# EAGLE schematic Orion Ground Base (EAGLE 9.2.2)
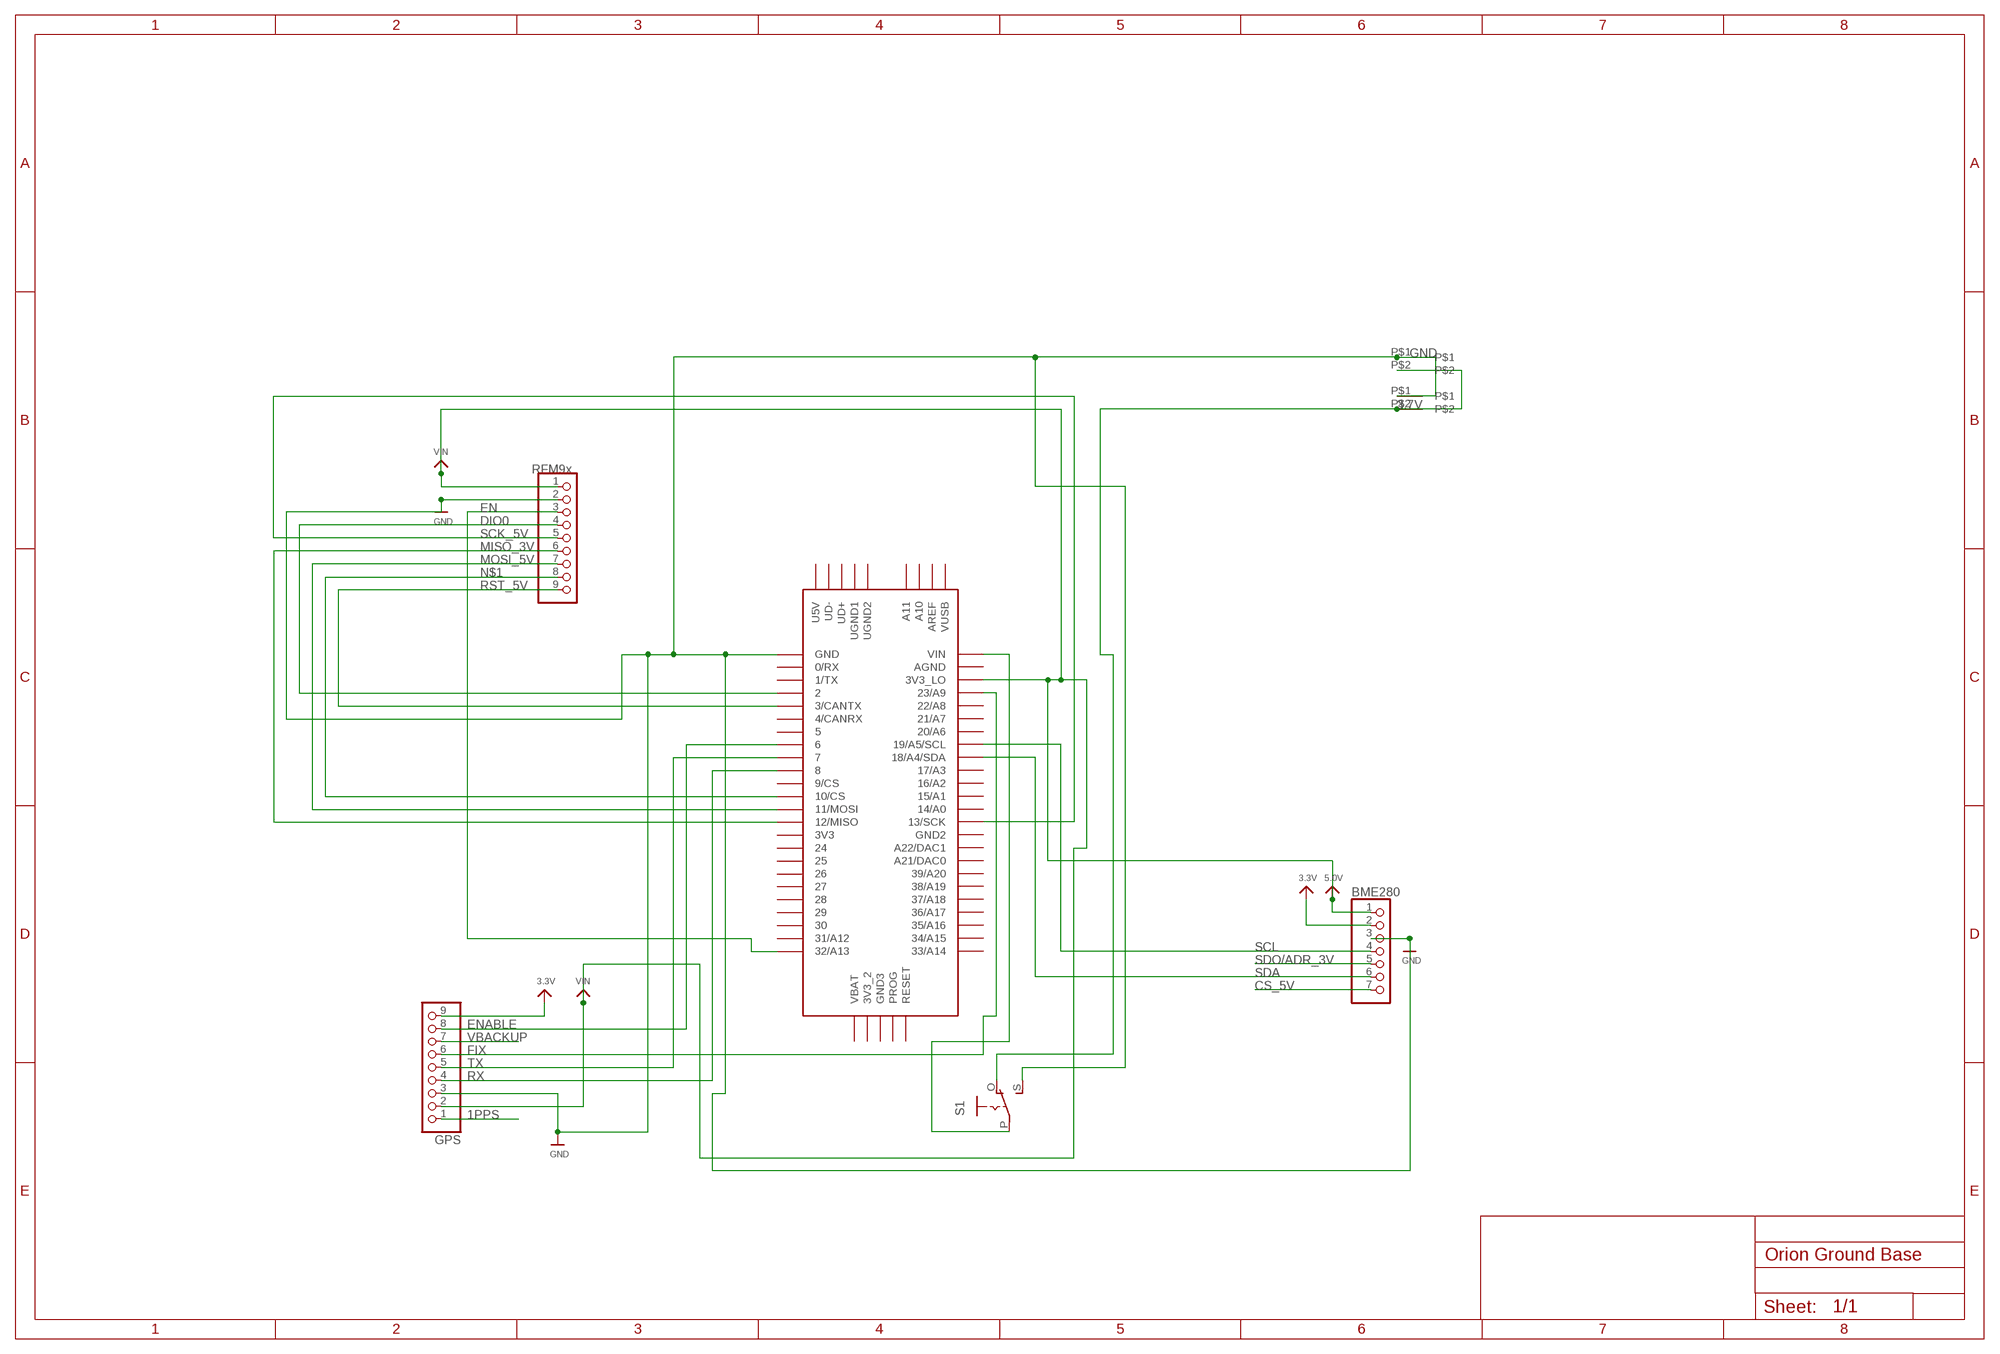
[diagram p0: schematic, sheet 1]

## Parts
BME280  HEADER-1X770MIL  [1X07_ROUND_70]
GPS  HEADER-1X970MIL  [1X09_ROUND_70]
JP3  HEADER-1X970MIL  [1X09_ROUND_70]
S1  EG1218S  [EG1218]
U$1  TEENSY_3.5/3.6  [TEENSY_3.5/3.6]
U$7  2PINS  [2PINS]
U$8  2PINS  [2PINS]

## Nets
1PPS: GPS.1
3.3V: BME280.2 GPS.9
CS_5V: BME280.7
DIO0: JP3.4 U$1.2
EN: JP3.3 U$1.32/A13
ENABLE: GPS.8 U$1.6
FIX: GPS.6 U$1.23/A9
GND: BME280.3 GPS.3 JP3.2 S1.S U$1.GND U$7.P$1 U$8.P$1
MISO_3V: JP3.6 U$1.12/MISO
MOSI_5V: JP3.7 U$1.11/MOSI
N$1: JP3.8 U$1.10/CS
N$3: S1.P U$1.VIN
N$16: S1.O U$7.P$2 U$8.P$2
RST_5V: JP3.9 U$1.3/CANTX
RX: GPS.4 U$1.8
SCK_5V: JP3.5 U$1.13/SCK
SCL: BME280.4 U$1.19/A5/SCL
SDA: BME280.6 U$1.18/A4/SDA
SDO/ADR_3V: BME280.5
TX: GPS.5 U$1.7
VBACKUP: GPS.7
VIN: BME280.1 GPS.2 JP3.1 U$1.3V3_LO ; supply symbol labelled 5.0V
Unconnected: U$1.0/RX U$1.1/TX U$1.3V3 U$1.3V3_2 U$1.4/CANRX U$1.5 U$1.9/CS U$1.14/A0 U$1.15/A1 U$1.16/A2 U$1.17/A3 U$1.20/A6 U$1.21/A7 U$1.21/DAC0(A21/DAC0) U$1.22/A8 U$1.24 U$1.25 U$1.26 U$1.27 U$1.28 U$1.29 U$1.30 U$1.31/A12 U$1.33/A14 U$1.34/A15 U$1.35/A16 U$1.36/A17 U$1.37/A18 U$1.38/A19 U$1.39/A20 U$1.A10 U$1.A11 U$1.A22/DAC1 U$1.AGND U$1.AREF U$1.GND2 U$1.GND3 U$1.PROG U$1.RESET U$1.U5V U$1.UD+ U$1.UD- U$1.UGND1 U$1.UGND2 U$1.VBAT U$1.VUSB

## Notes on the sheet
- GND
- 3.7V
- RFM9x

## Library data of the parts
BME280 = microbuilder:HEADER-1X7: PIN HEADER
GPS JP3 = microbuilder:HEADER-1X9: PIN HEADER
S1 = switch:EG1218: SLIDING SWITCH 0.1" spacing through hole, vertical SPDT slide switch http://www.ladyada.net/library/pcb/eaglelibrary.html
U$1 = teensy356:TEENSY_3.5/3.6
U$7 U$8 = 6pins:2PINS